# Altium project 7SEG.PrjPCB
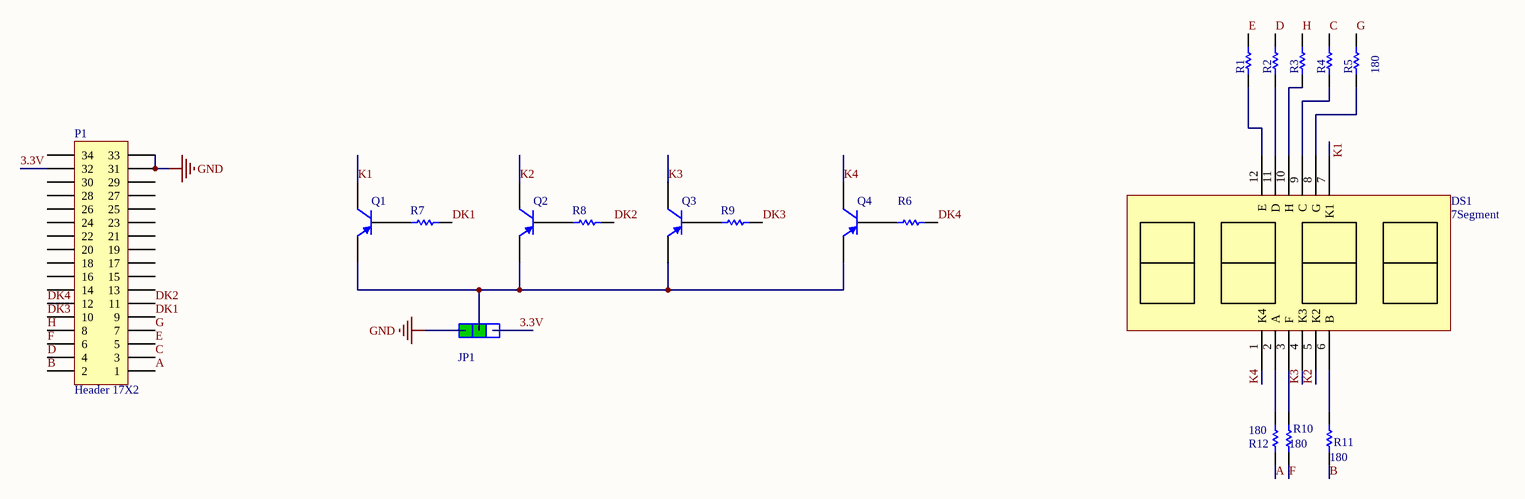
[diagram p0: 7SEG.SchDoc]
1 sheet, 19 parts. Net scope: global (net labels, ports and power ports of the same name join across sheets).
Board file: 7-SEGMENT.PcbDoc

## Sheet 7SEG.SchDoc
size B

### Parts
DS1  7Segment  [7Segment]
JP1  Jumper  [JT3]  (value not drawn)
P1  Header 17X2  [HDR1X17]
Q1  BC857C  [SOT-23A_N]  (value not drawn)
Q2  BC857C  [SOT-23A_N]  (value not drawn)
Q3  BC857C  [SOT-23A_N]  (value not drawn)
Q4  BC857C  [SOT-23A_N]  (value not drawn)
R1  180  [1206]  (value not drawn)
R2  180  [1206]  (value not drawn)
R3  180  [1206]  (value not drawn)
R4  180  [1206]  (value not drawn)
R5  180  [1206]
R6  10K  [1206]  (value not drawn)
R7  10K  [1206]  (value not drawn)
R8  10K  [1206]  (value not drawn)
R9  10K  [1206]  (value not drawn)
R10  180  [1206]
R11  180  [1206]
R12  180  [1206]

### Nets
GND: JP1.1 P1.31 P1.33
3.3V: JP1.3 P1.32
A: P1.1 R12.2
B: P1.2 R11.2
C: P1.3 R4.1
D: P1.4 R2.1
DK1: P1.9 R7.2
DK2: P1.11 R8.2
DK3: P1.10 R9.2
DK4: P1.12 R6.2
E: P1.5 R1.1
F: P1.6 R10.2
G: P1.7 R5.1
H: P1.8 R3.1
K1: DS1.7(K1) Q1.3(C)
K2: DS1.5(K2) Q2.3(C)
K3: DS1.4(K3) Q3.3(C)
K4: DS1.1(K4) Q4.3(C)
NetDS1_2: DS1.2(A) R12.1
NetDS1_3: DS1.3(F) R10.1
NetDS1_6: DS1.6(B) R11.1
NetDS1_8: DS1.8(G) R5.2
NetDS1_9: DS1.9(C) R4.2
NetDS1_10: DS1.10(H) R3.2
NetDS1_11: DS1.11(D) R2.2
NetDS1_12: DS1.12(E) R1.2
NetJP1_2: JP1.2 Q1.2(E) Q2.2(E) Q3.2(E) Q4.2(E)
NetQ1_1: Q1.1(B) R7.1
NetQ2_1: Q2.1(B) R8.1
NetQ3_1: Q3.1(B) R9.1
NetQ4_1: Q4.1(B) R6.1

Not connected (* = marked no-connect by the designer): P1 13 14 15 16 17 18 19 20 21 22 23 24 25 26 27 28 29 30 34

### Library data of the parts
JP1 = Jumper Selector
P1 = Header 17X2: Header, 17-Pin, Dual row; LatestRevisionDate: 17-Jul-2002; LatestRevisionNote: Re-released for DXP Platform.; Publisher: Altium Limited
Q1-Q4 = BC857C: PNP General Purpose Amplifier; Published: 8-Jun-2000; LatestRevisionDate: 20-Nov-2009; LatestRevisionNote: IPC-7351 Footprint Added.; DatasheetVersion: 1997; PackageVersion: Sep-1998; PackageReference: SOT-23A; Publisher: Altium Limited; PackageDescription: 3-Pin SOT-23 Package 0.95 mm Pitch, 2.3 mm Lead Span; ComponentLink1Description: Manufacturer Link; ComponentLink1URL: http://www.fairchildsemi.com/; ComponentLink2Description: Datasheet; ComponentLink2URL: http://www.fairchildsemi.com/ds/BC%2FBC857.pdf
R1-R3 R6-R12 = Res1: Resistor; Value: 1K; Published: 8-Jun-2000; LatestRevisionDate: 17-Jul-2002; LatestRevisionNote: Re-released for DXP Platform.; PackageReference: AXIAL-0.3; Publisher: Altium Limited; PackageDescription: Axial Device, Thru-Hole; 2 Leads; 0.3 in Pin Spacing
R4 R5 = Res1: Resistor; Value: 1; Published: 8-Jun-2000; LatestRevisionDate: 17-Jul-2002; LatestRevisionNote: Re-released for DXP Platform.; PackageReference: AXIAL-0.3; Publisher: Altium Limited; PackageDescription: Axial Device, Thru-Hole; 2 Leads; 0.3 in Pin Spacing